# EAGLE schematic adc2018 (EAGLE 8.5.0)
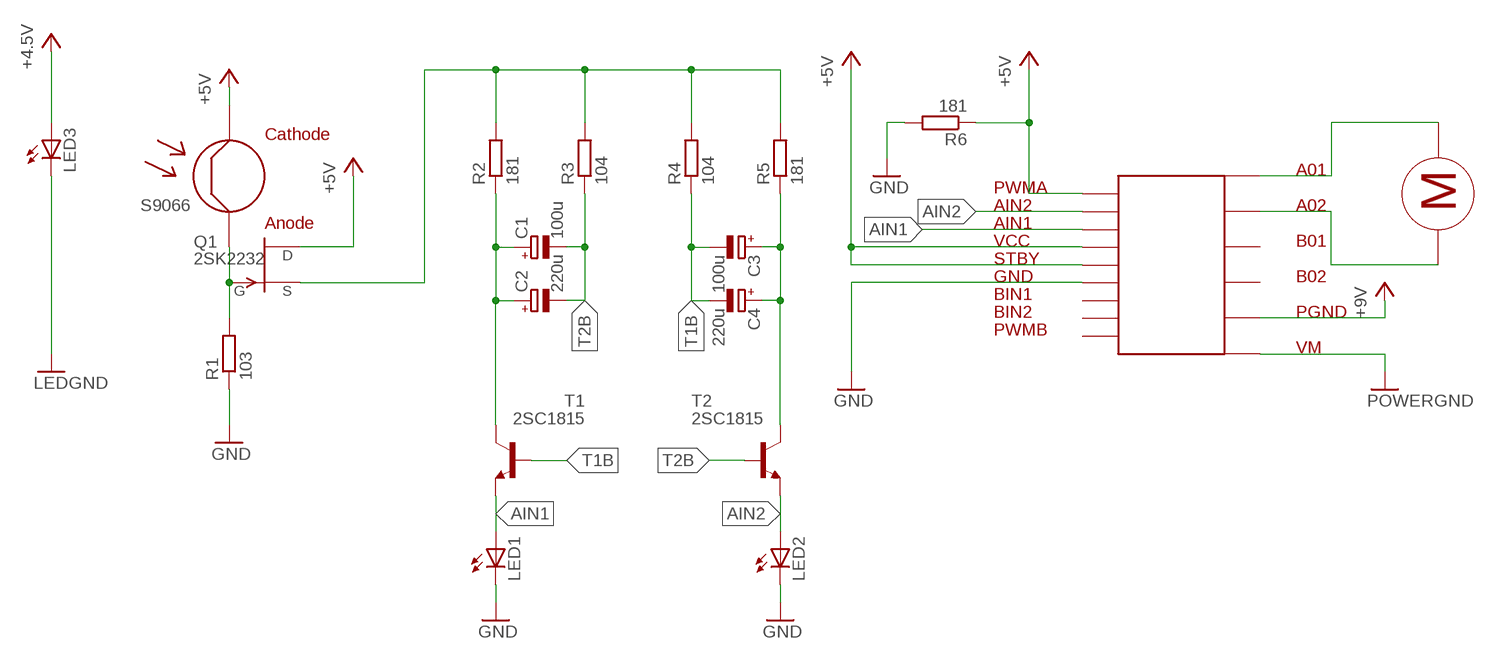
[diagram p0: schematic, sheet 1]

## Parts
C1  100u  CPOL-EUE2-5  [E2-5]
C2  220u  CPOL-EUE2-5  [E2-5]
C3  100u  CPOL-EUE2-5  [E2-5]
C4  220u  CPOL-EUE2-5  [E2-5]
D1  S9066  [S9066]
LED1  LED5MM  [LED5MM]
LED2  LED5MM  [LED5MM]
LED3  LED5MM  [LED5MM]
M1  MOTOR  [MOTOR]
MD1  TB6612  [TB6612]
Q1  2SK2232  [2SK241]
R1  103  R-EU_0617/22  [0617/22]
R2  181  R-EU_0617/22  [0617/22]
R3  104  R-EU_0617/22  [0617/22]
R4  104  R-EU_0617/22  [0617/22]
R5  181  R-EU_0617/22  [0617/22]
R6  181  R-EU_0309/12  [0309/12]
T1  2SC1815  [TO92-ECB]
T2  2SC1815  [TO92-ECB]

## Nets
+5V: D1.P$1 LED3.A MD1.P$1 MD1.P$4 MD1.P$5 MD1.P$13 Q1.1(D) R6.1 ; supply symbol labelled +4.5V, +9V
AIN1: LED1.A MD1.P$3 T1.E
AIN2: LED2.A MD1.P$2 T2.E
GND: LED1.K(C) LED2.K(C) LED3.K(C) MD1.P$6 MD1.P$15 R1.1 R6.2 ; supply symbol labelled LEDGND, POWERGND
N$1: D1.P$2 Q1.2(G) R1.2
N$2: Q1.3(S) R2.2 R3.2 R4.2 R5.2
N$3: C1.+ C2.+ R2.1 T1.C
N$4: M1.P$2 MD1.P$14
N$5: M1.P$1 MD1.P$10
N$6: C3.+ C4.+ R5.1 T2.C
T1B: C3.- C4.- R4.1 T1.B
T2B: C1.- C2.- R3.1 T2.B
Unconnected: MD1.P$7 MD1.P$8 MD1.P$9 MD1.P$11 MD1.P$12

## Library data of the parts
C1-C4 = rcl:CPOL-EU: POLARIZED CAPACITOR, European symbol; SPICEPREFIX: C
D1 = s9066:S9066
LED1-LED3 = led:LED: LED OSRAM: - CHIPLED LG R971, LG N971, LY N971, LG Q971, LY Q971, LO R971, LY R971 LH N974, LH R974 LS Q976, LO Q976, LY Q976 LO Q996 - Hyper CHIPLED LW Q18S LB Q993, LB Q99A, LB R99A - SideLED LS A670, LO A670, LY A670, LG A670, LP A670 LB A673, LV A673, LT A673, LW A673 LH A674 LY A675 LS A676, LA A676, LO A676, LY A676, LW A676 LS A679, LY A679, LG A679 - Hyper Micro SIDELED® LS Y876, LA Y876, LO Y876, LY Y876 LT Y87S - SmartLED LW L88C, LW L88S LB L89C, LB L89S, LG L890 LS L89K, LO L89K, LY L89K LS L896, LA L896, LO L896, LY L896 - TOPLED LS T670, LO T670, LY T670, LG T670, LP T670 LSG T670, LSP T670, LSY T670, LOP T670, LYG T670 LG T671, LOG T671, LSG T671 LB T673, LV T673, LT T673, LW T673 LH T674 LS T676, LA T676, LO T676, LY T676, LB T676, LH T676, LSB T676, LW T676 LB T67C, LV T67C, LT T67C, LS T67K, LO T67K, LY T67K, LW E67C LS E67B, LA E67B, LO E67B, LY E67B, LB E67C, LV E67C, LT E67C LW T67C LS T679, LY T679, LG T679 LS T770, LO T770, LY T770, LG T770, LP T770 LB T773, LV T773, LT T773, LW T773 LH T774 LS E675, LA E675, LY E675, LS T675 LS T776, LA T776, LO T776, LY T776, LB T776 LHGB T686 LT T68C, LB T68C - Hyper Mini TOPLED® LB M676 - Mini TOPLED Santana® LG M470 LS M47K, LO M47K, LY M47K Source: http://www.osram.convergy.de LUXEON: - LUMILED® LXK2-PW12-R00, LXK2-PW12-S00, LXK2-PW14-U00, LXK2-PW14-V00 LXK2-PM12-R00, LXK2-PM12-S00, LXK2-PM14-U00 LXK2-PE12-Q00, LXK2-PE12-R00, LXK2-PE12-S00, LXK2-PE14-T00, LXK2-PE14-U00 LXK2-PB12-K00, LXK2-PB12-L00, LXK2-PB12-M00, LXK2-PB14-N00, LXK2-PB14-P00, LXK2-PB14-Q00 LXK2-PR12-L00, LXK2-PR12-M00, LXK2-PR14-Q00, LXK2-PR14-R00 LXK2-PD12-Q00, LXK2-PD12-R00, LXK2-PD12-S00 LXK2-PH12-R00, LXK2-PH12-S00 LXK2-PL12-P00, LXK2-PL12-Q00, LXK2-PL12-R00 Source: www.luxeon.com KINGBRIGHT: KA-3528ASYC Source: www.kingbright.com
M1 = motor:MOTOR
MD1 = tb6612:TB6612
Q1 = 2sk2232:2SK2232
R1-R6 = rcl:R-EU_: RESISTOR, European symbol; SPICEPREFIX: R
T1 T2 = transistor:2SC1815: NPN EPITAXIAL TRANSISTOR Source: TOSHIBA .. 2SC1815 1.pdf